# Altium schematic sheet MCU.SchDoc
size 431 x 279 mm; Organization: ORGANIZATION; Address1: 207; Address2: 13399 104 Ave; Address3: Surrey BC, V3T 0C9; Address4: Canada; Revision: V0.0.0; SheetNumber: 4; SheetTotal: 5; ENG_APP_DATE: --/--/--; DSN_APP_DATE: --/--/--; CHK_APP_DATE: --/--/--
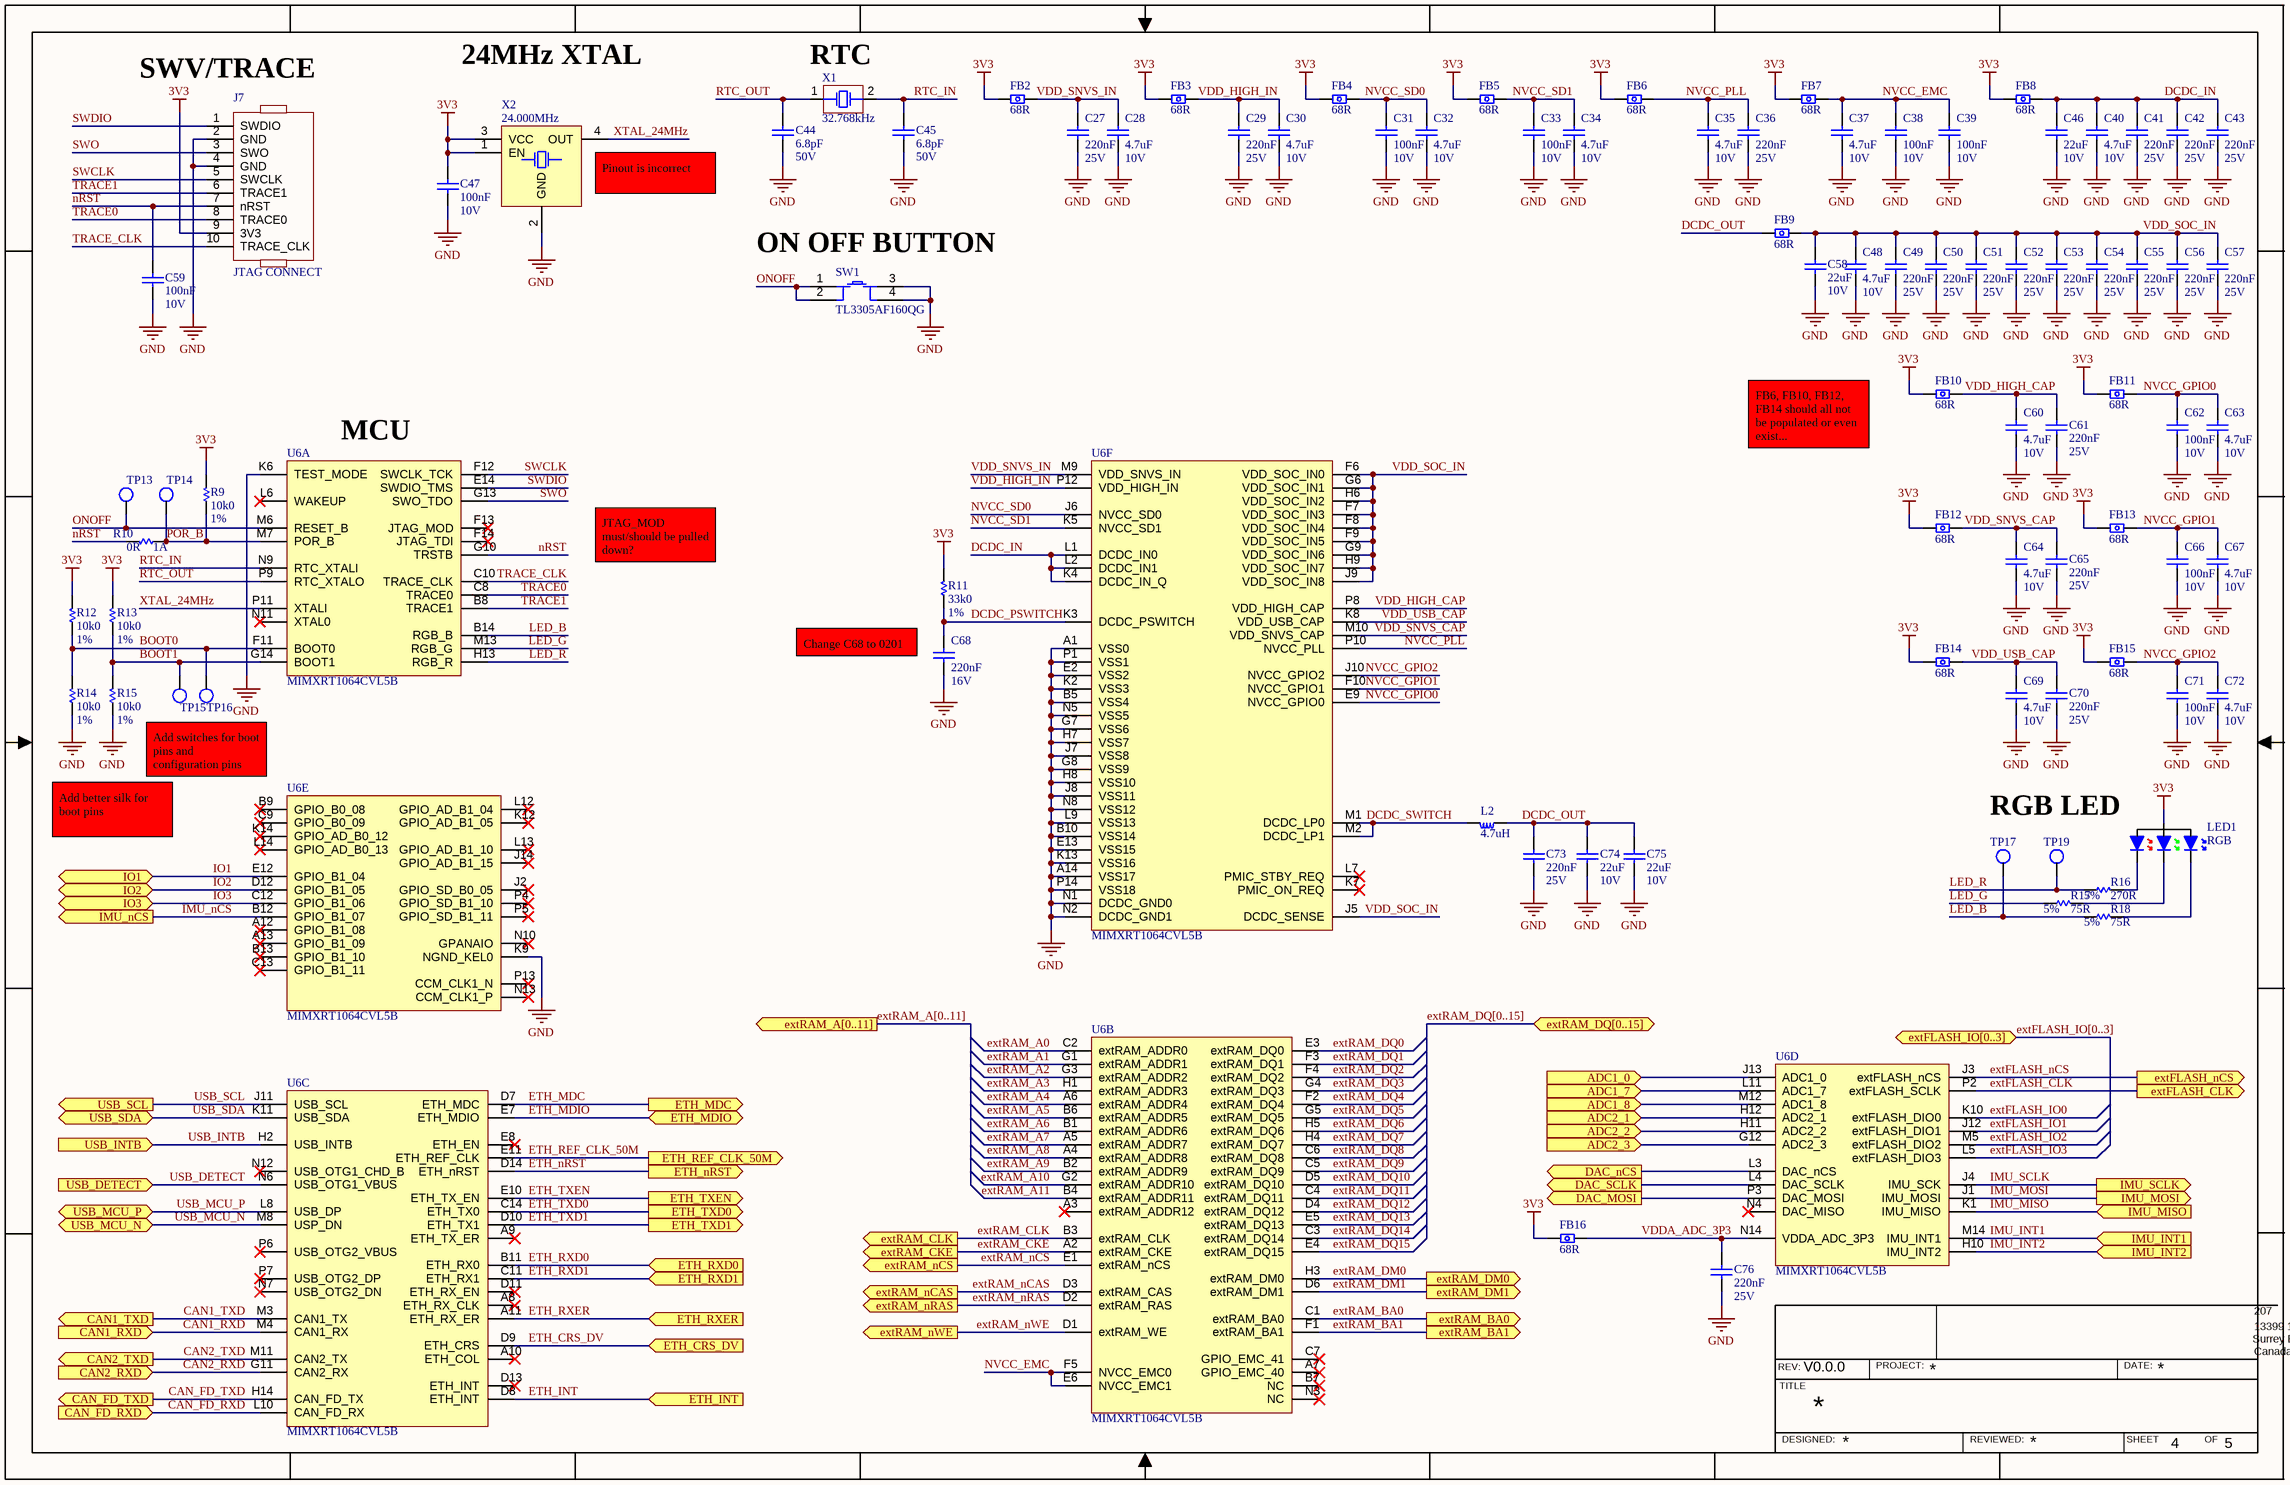
[diagram p0: MCU.SchDoc]

## Parts
C27  220nF  Voltage: 25V  [c0201]
C28  4.7uF  Voltage Rating: 10V  [C0402]
C29  220nF  Voltage: 25V  [c0201]
C30  4.7uF  Voltage Rating: 10V  [C0402]
C31  100nF  Voltage Rating: 10V  [C0201]
C32  4.7uF  Voltage Rating: 10V  [C0402]
C33  100nF  Voltage Rating: 10V  [C0201]
C34  4.7uF  Voltage Rating: 10V  [C0402]
C35  4.7uF  Voltage Rating: 10V  [C0402]
C36  220nF  Voltage: 25V  [c0201]
C37  4.7uF  Voltage Rating: 10V  [C0402]
C38  100nF  Voltage Rating: 10V  [C0201]
C39  100nF  Voltage Rating: 10V  [C0201]
C40  4.7uF  Voltage Rating: 10V  [C0402]
C41  220nF  Voltage: 25V  [c0201]
C42  220nF  Voltage: 25V  [c0201]
C43  220nF  Voltage: 25V  [c0201]
C44  6.8pF  Voltage: 50V  [C0402]
C45  6.8pF  Voltage: 50V  [C0402]
C46  22uF  Voltage Rating: 10V  [c0603]
C47  100nF  Voltage Rating: 10V  [C0201]
C48  4.7uF  Voltage Rating: 10V  [C0402]
C49  220nF  Voltage: 25V  [c0201]
C50  220nF  Voltage: 25V  [c0201]
C51  220nF  Voltage: 25V  [c0201]
C52  220nF  Voltage: 25V  [c0201]
C53  220nF  Voltage: 25V  [c0201]
C54  220nF  Voltage: 25V  [c0201]
C55  220nF  Voltage: 25V  [c0201]
C56  220nF  Voltage: 25V  [c0201]
C57  220nF  Voltage: 25V  [c0201]
C58  22uF  Voltage Rating: 10V  [c0603]
C59  100nF  Voltage Rating: 10V  [C0201]
C60  4.7uF  Voltage Rating: 10V  [C0402]
C61  220nF  Voltage: 25V  [c0201]
C62  100nF  Voltage Rating: 10V  [C0201]
C63  4.7uF  Voltage Rating: 10V  [C0402]
C64  4.7uF  Voltage Rating: 10V  [C0402]
C65  220nF  Voltage: 25V  [c0201]
C66  100nF  Voltage Rating: 10V  [C0201]
C67  4.7uF  Voltage Rating: 10V  [C0402]
C68  220nF  Voltage Rating: 16V  [C0402]
C69  4.7uF  Voltage Rating: 10V  [C0402]
C70  220nF  Voltage: 25V  [c0201]
C71  100nF  Voltage Rating: 10V  [C0201]
C72  4.7uF  Voltage Rating: 10V  [C0402]
C73  220nF  Voltage: 25V  [c0201]
C74  22uF  Voltage Rating: 10V  [c0603]
C75  22uF  Voltage Rating: 10V  [c0603]
C76  220nF  Voltage: 25V  [c0201]
FB2  68R  [FB0402]
FB3  68R  [FB0402]
FB4  68R  [FB0402]
FB5  68R  [FB0402]
FB6  68R  [FB0402]
FB7  68R  [FB0402]
FB8  68R  [FB0402]
FB9  68R  [FB0402]
FB10  68R  [FB0402]
FB11  68R  [FB0402]
FB12  68R  [FB0402]
FB13  68R  [FB0402]
FB14  68R  [FB0402]
FB15  68R  [FB0402]
FB16  68R  [FB0402]
J7  JTAG CONNECT  [TAG_CONNECT_10PIN]  (no BOM)
L2  4.7uH  [INDP3030X12N]
LED1  RGB  [LED RGB UHD1110-FKA-CL1A13R3Q1BBQFMF3]
R9  10k0  Tolerance: 1%  [r0402]
R10  0R  Current Rating: 1A  [R0402]
R11  33k0  Tolerance: 1%  [r0402]
R12  10k0  Tolerance: 1%  [r0402]
R13  10k0  Tolerance: 1%  [r0402]
R14  10k0  Tolerance: 1%  [r0402]
R15  10k0  Tolerance: 1%  [r0402]
R16  270R  Tolerance: 5%  [r0402]
R17  75R  Tolerance: 5%  [R0402]
R18  75R  Tolerance: 5%  [R0402]
SW1  TL3305AF160QG  [MECH PB TL3305A]
TP13  1mm  [TESTPOINT_SMT]  (value not drawn)  (no BOM)
TP14  1mm  [TESTPOINT_SMT]  (value not drawn)  (no BOM)
TP15  1mm  [TESTPOINT_SMT]  (value not drawn)  (no BOM)
TP16  1mm  [TESTPOINT_SMT]  (value not drawn)  (no BOM)
TP17  1mm  [TESTPOINT_SMT]  (value not drawn)  (no BOM)
TP19  1mm  [TESTPOINT_SMT]  (value not drawn)  (no BOM)
U6  MIMXRT1064CVL5B  [BGA196C65P14X14_1000X1000X143]  (parts A,B,C,D,E,F of 6)
X1  32.768kHz  [XTAL 3.2x1.5mm]
X2  24.000MHz  [XTAL FA-238V 3.2x2.5mm]

## Ports
ADC1_0 (in), ADC1_7 (in), ADC1_8 (in), ADC2_1 (in), ADC2_2 (in), ADC2_3 (in), CAN1_RXD (in), CAN1_TXD (out), CAN2_RXD (in), CAN2_TXD (out), CAN_FD_RXD (in), CAN_FD_TXD (out), DAC_MOSI (out), DAC_nCS (out), DAC_SCLK (out), ETH_CRS_DV (in), ETH_INT (in), ETH_MDC (out), ETH_MDIO (bidir), ETH_nRST (out), ETH_REF_CLK_50M (out), ETH_RXD0 (in), ETH_RXD1 (in), ETH_RXER (in), ETH_TXD0 (out), ETH_TXD1 (out), ETH_TXEN (out), extFLASH_CLK (out), extFLASH_IO[0..3] (bidir), extFLASH_nCS (out), extRAM_A[0..11] (out), extRAM_BA0 (out), extRAM_BA1 (out), extRAM_CKE (out), extRAM_CLK (out), extRAM_DM0 (out), extRAM_DM1 (out), extRAM_DQ[0..15] (bidir), extRAM_nCAS (out), extRAM_nCS (out), extRAM_nRAS (out), extRAM_nWE (out), IMU_INT1 (in), IMU_INT2 (in), IMU_MISO (in), IMU_MOSI (out), IMU_nCS (out), IMU_SCLK (out), IO1 (bidir), IO2 (bidir), IO3 (bidir), USB_DETECT (in), USB_INTB (in), USB_MCU_N (bidir), USB_MCU_P (bidir), USB_SCL (out), USB_SDA (bidir)

## Nets
3V3: C47.2 FB2.2 FB3.2 FB4.2 FB5.2 FB6.2 FB7.2 FB8.2 FB10.2 FB11.2 FB12.2 FB13.2 FB14.2 FB15.2 FB16.2 J7.9(3V3) LED1.4(A) R9.2 R11.2 R12.2 R13.2 X2.1(EN) X2.3(VCC)
GND: C27.1 C28.1 C29.1 C30.1 C31.1 C32.1 C33.1 C34.1 C35.1 C36.1 C37.1 C38.1 C39.1 C40.1 C41.1 C42.1 C43.1 C44.1 C45.1 C46.1 C47.1 C48.1 C49.1 C50.1 C51.1 C52.1 C53.1 C54.1 C55.1 C56.1 C57.1 C58.1 C59.1 C60.1 C61.1 C62.1 C63.1 C64.1 C65.1 C66.1 C67.1 C68.1 C69.1 C70.1 C71.1 C72.1 C73.1 C74.1 C75.1 C76.1 J7.2(GND) J7.4(GND) R14.1 R15.1 SW1.3 SW1.4 U6.A1(VSS0) U6.A14(VSS17) U6.B5(VSS4) U6.B10(VSS14) U6.E2(VSS2) U6.E13(VSS15) U6.G7(VSS6) U6.G8(VSS9) U6.H7(VSS7) U6.H8(VSS10) U6.J7(VSS8) U6.J8(VSS11) U6.K2(VSS3) U6.K6(TEST_MODE) U6.K9(NGND_KEL0) U6.K13(VSS16) U6.L9(VSS13) U6.N1(DCDC_GND0) U6.N2(DCDC_GND1) U6.N5(VSS5) U6.N8(VSS12) U6.P1(VSS1) U6.P14(VSS18) X2.2(GND)
ADC1_0: U6.J13(ADC1_0) ; port ADC1_0
ADC1_7: U6.L11(ADC1_7) ; port ADC1_7
ADC1_8: U6.M12(ADC1_8) ; port ADC1_8
ADC2_1: U6.H12(ADC2_1) ; port ADC2_1
ADC2_2: U6.H11(ADC2_2) ; port ADC2_2
ADC2_3: U6.G12(ADC2_3) ; port ADC2_3
BOOT0: R12.1 R14.2 TP16.1 U6.F11(BOOT0)
BOOT1: R13.1 R15.2 TP15.1 U6.G14(BOOT1)
CAN1_RXD: U6.M4(CAN1_RX) ; port CAN1_RXD
CAN1_TXD: U6.M3(CAN1_TX) ; port CAN1_TXD
CAN2_RXD: U6.G11(CAN2_RX) ; port CAN2_RXD
CAN2_TXD: U6.M11(CAN2_TX) ; port CAN2_TXD
CAN_FD_RXD: U6.L10(CAN_FD_RX) ; port CAN_FD_RXD
CAN_FD_TXD: U6.H14(CAN_FD_TX) ; port CAN_FD_TXD
DAC_MOSI: U6.P3(DAC_MOSI) ; port DAC_MOSI
DAC_nCS: U6.L3(DAC_nCS) ; port DAC_nCS
DAC_SCLK: U6.L4(DAC_SCLK) ; port DAC_SCLK
DCDC_IN: C40.2 C41.2 C42.2 C43.2 C46.2 FB8.1 U6.K4(DCDC_IN_Q) U6.L1(DCDC_IN0) U6.L2(DCDC_IN1)
DCDC_OUT: C73.2 C74.2 C75.2 FB9.2 L2.2
DCDC_PSWITCH: C68.2 R11.1 U6.K3(DCDC_PSWITCH)
DCDC_SWITCH: L2.1 U6.M1(DCDC_LP0) U6.M2(DCDC_LP1)
ETH_CRS_DV: U6.D9(ETH_CRS) ; port ETH_CRS_DV
ETH_INT: U6.D8(ETH_INT) ; port ETH_INT
ETH_MDC: U6.D7(ETH_MDC) ; port ETH_MDC
ETH_MDIO: U6.E7(ETH_MDIO) ; port ETH_MDIO
ETH_nRST: U6.D14(ETH_nRST) ; port ETH_nRST
ETH_REF_CLK_50M: U6.E11(ETH_REF_CLK) ; port ETH_REF_CLK_50M
ETH_RXD0: U6.B11(ETH_RX0) ; port ETH_RXD0
ETH_RXD1: U6.C11(ETH_RX1) ; port ETH_RXD1
ETH_RXER: U6.A11(ETH_RX_ER) ; port ETH_RXER
ETH_TXD0: U6.C14(ETH_TX0) ; port ETH_TXD0
ETH_TXD1: U6.D10(ETH_TX1) ; port ETH_TXD1
ETH_TXEN: U6.E10(ETH_TX_EN) ; port ETH_TXEN
extFLASH_CLK: U6.P2(extFLASH_SCLK) ; port extFLASH_CLK
extFLASH_IO0: U6.K10(extFLASH_DIO0)
extFLASH_IO1: U6.J12(extFLASH_DIO1)
extFLASH_IO2: U6.M5(extFLASH_DIO2)
extFLASH_IO3: U6.L5(extFLASH_DIO3)
extFLASH_nCS: U6.J3(extFLASH_nCS) ; port extFLASH_nCS
extRAM_A0: U6.C2(extRAM_ADDR0)
extRAM_A1: U6.G1(extRAM_ADDR1)
extRAM_A2: U6.G3(extRAM_ADDR2)
extRAM_A3: U6.H1(extRAM_ADDR3)
extRAM_A4: U6.A6(extRAM_ADDR4)
extRAM_A5: U6.B6(extRAM_ADDR5)
extRAM_A6: U6.B1(extRAM_ADDR6)
extRAM_A7: U6.A5(extRAM_ADDR7)
extRAM_A8: U6.A4(extRAM_ADDR8)
extRAM_A9: U6.B2(extRAM_ADDR9)
extRAM_A10: U6.G2(extRAM_ADDR10)
extRAM_A11: U6.B4(extRAM_ADDR11)
extRAM_BA0: U6.C1(extRAM_BA0) ; port extRAM_BA0
extRAM_BA1: U6.F1(extRAM_BA1) ; port extRAM_BA1
extRAM_CKE: U6.A2(extRAM_CKE) ; port extRAM_CKE
extRAM_CLK: U6.B3(extRAM_CLK) ; port extRAM_CLK
extRAM_DM0: U6.H3(extRAM_DM0) ; port extRAM_DM0
extRAM_DM1: U6.D6(extRAM_DM1) ; port extRAM_DM1
extRAM_DQ0: U6.E3(extRAM_DQ0)
extRAM_DQ1: U6.F3(extRAM_DQ1)
extRAM_DQ2: U6.F4(extRAM_DQ2)
extRAM_DQ3: U6.G4(extRAM_DQ3)
extRAM_DQ4: U6.F2(extRAM_DQ4)
extRAM_DQ5: U6.G5(extRAM_DQ5)
extRAM_DQ6: U6.H5(extRAM_DQ6)
extRAM_DQ7: U6.H4(extRAM_DQ7)
extRAM_DQ8: U6.C6(extRAM_DQ8)
extRAM_DQ9: U6.C5(extRAM_DQ9)
extRAM_DQ10: U6.D5(extRAM_DQ10)
extRAM_DQ11: U6.C4(extRAM_DQ11)
extRAM_DQ12: U6.D4(extRAM_DQ12)
extRAM_DQ13: U6.E5(extRAM_DQ13)
extRAM_DQ14: U6.C3(extRAM_DQ14)
extRAM_DQ15: U6.E4(extRAM_DQ15)
extRAM_nCAS: U6.D3(extRAM_CAS) ; port extRAM_nCAS
extRAM_nCS: U6.E1(extRAM_nCS) ; port extRAM_nCS
extRAM_nRAS: U6.D2(extRAM_RAS) ; port extRAM_nRAS
extRAM_nWE: U6.D1(extRAM_WE) ; port extRAM_nWE
IMU_INT1: U6.M14(IMU_INT1) ; port IMU_INT1
IMU_INT2: U6.H10(IMU_INT2) ; port IMU_INT2
IMU_MISO: U6.K1(IMU_MISO) ; port IMU_MISO
IMU_MOSI: U6.J1(IMU_MOSI) ; port IMU_MOSI
IMU_nCS: U6.B12(GPIO_B1_07) ; port IMU_nCS
IMU_SCLK: U6.J4(IMU_SCK) ; port IMU_SCLK
IO1: U6.E12(GPIO_B1_04) ; port IO1
IO2: U6.D12(GPIO_B1_05) ; port IO2
IO3: U6.C12(GPIO_B1_06) ; port IO3
LED_B: R18.1 TP17.1 U6.B14(RGB_B)
LED_G: R17.1 U6.M13(RGB_G)
LED_R: R16.1 TP19.1 U6.H13(RGB_R)
nRST: C59.2 J7.7(nRST) R10.2 U6.G10(TRSTB)
NVCC_EMC: C37.2 C38.2 C39.2 FB7.1 U6.E6(NVCC_EMC1) U6.F5(NVCC_EMC0)
NVCC_GPIO0: C62.2 C63.2 FB11.1 U6.E9(NVCC_GPIO0)
NVCC_GPIO1: C66.2 C67.2 FB13.1 U6.F10(NVCC_GPIO1)
NVCC_GPIO2: C71.2 C72.2 FB15.1 U6.J10(NVCC_GPIO2)
NVCC_PLL: C35.2 C36.2 FB6.1 U6.P10(NVCC_PLL)
NVCC_SD0: C31.2 C32.2 FB4.1 U6.J6(NVCC_SD0)
NVCC_SD1: C33.2 C34.2 FB5.1 U6.K5(NVCC_SD1)
ONOFF: SW1.1 SW1.2 TP13.1 U6.M6(RESET_B)
POR_B: R9.1 R10.1 TP14.1 U6.M7(POR_B)
RTC_IN: C45.2 U6.N9(RTC_XTALI) X1.2
RTC_OUT: C44.2 U6.P9(RTC_XTALO) X1.1
SWCLK: J7.5(SWCLK) U6.F12(SWCLK_TCK)
SWDIO: J7.1(SWDIO) U6.E14(SWDIO_TMS)
SWO: J7.3(SWO) U6.G13(SWO_TDO)
TRACE0: J7.8(TRACE0) U6.C8(TRACE0)
TRACE1: J7.6(TRACE1) U6.B8(TRACE1)
TRACE_CLK: J7.10(TRACE_CLK) U6.C10(TRACE_CLK)
USB_DETECT: U6.N6(USB_OTG1_VBUS) ; port USB_DETECT
USB_INTB: U6.H2(USB_INTB) ; port USB_INTB
USB_MCU_N: U6.M8(USP_DN) ; port USB_MCU_N
USB_MCU_P: U6.L8(USB_DP) ; port USB_MCU_P
USB_SCL: U6.J11(USB_SCL) ; port USB_SCL
USB_SDA: U6.K11(USB_SDA) ; port USB_SDA
VDD_HIGH_CAP: C60.2 C61.2 FB10.1 U6.P8(VDD_HIGH_CAP)
VDD_HIGH_IN: C29.2 C30.2 FB3.1 U6.P12(VDD_HIGH_IN)
VDD_SNVS_CAP: C64.2 C65.2 FB12.1 U6.M10(VDD_SNVS_CAP)
VDD_SNVS_IN: C27.2 C28.2 FB2.1 U6.M9(VDD_SNVS_IN)
VDD_SOC_IN: C48.2 C49.2 C50.2 C51.2 C52.2 C53.2 C54.2 C55.2 C56.2 C57.2 C58.2 FB9.1 U6.F6(VDD_SOC_IN0) U6.F7(VDD_SOC_IN3) U6.F8(VDD_SOC_IN4) U6.F9(VDD_SOC_IN5) U6.G6(VDD_SOC_IN1) U6.G9(VDD_SOC_IN6) U6.H6(VDD_SOC_IN2) U6.H9(VDD_SOC_IN7) U6.J5(DCDC_SENSE) U6.J9(VDD_SOC_IN8)
VDD_USB_CAP: C69.2 C70.2 FB14.1 U6.K8(VDD_USB_CAP)
VDDA_ADC_3P3: C76.2 FB16.1 U6.N14(VDDA_ADC_3P3)
XTAL_24MHz: U6.P11(XTALI) X2.4(OUT)
NetLED1_1: LED1.1(K) R18.2
NetLED1_2: LED1.2(K) R17.2
NetLED1_3: LED1.3(K) R16.2

Not connected (* = marked no-connect by the designer): U6 A3(extRAM_ADDR12)* A7(GPIO_EMC_40)* A8(ETH_RX_CLK)* A9(ETH_TX_ER)* A10(ETH_COL)* A12(GPIO_B1_08)* A13(GPIO_B1_09)* B7(NC)* B9(GPIO_B0_08)* B13(GPIO_B1_10)* C7(GPIO_EMC_41)* C9(GPIO_B0_09)* C13(GPIO_B1_11)* D11(ETH_RX_EN)* D13(ETH_INT)* E8(ETH_EN)* F13(JTAG_MOD)* F14(JTAG_TDI)* J2(GPIO_SD_B0_05)* J14(GPIO_AD_B1_15)* K7(PMIC_ON_REQ)* K12(GPIO_AD_B1_05)* K14(GPIO_AD_B0_12)* L6(WAKEUP)* L7(PMIC_STBY_REQ)* L12(GPIO_AD_B1_04)* L13(GPIO_AD_B1_10)* L14(GPIO_AD_B0_13)* N3(NC)* N4(DAC_MISO)* N7(USB_OTG2_DN)* N10(GPANAIO)* N11(XTAL0)* N12(USB_OTG1_CHD_B)* N13(CCM_CLK1_P)* P4(GPIO_SD_B1_10)* P5(GPIO_SD_B1_11)* P6(USB_OTG2_VBUS)* P7(USB_OTG2_DP)* P13(CCM_CLK1_N)*

## Buses and harness runs
bus extFLASH_IO[0..3] = port extFLASH_IO[0..3]
bus extRAM_A[0..11] = port extRAM_A[0..11]
bus extRAM_DQ[0..15] = port extRAM_DQ[0..15]

## Notes on the sheet
- (near J7) SWV/TRACE
- 24MHz XTAL
- (near X1) RTC
- (near X2) Pinout is incorrect
- (near SW1) ON OFF BUTTON
- (near U6) MCU
- FB6, FB10, FB12, FB14 should all not be populated or even exist...
- JTAG_MOD must/should be pulled down?
- Change C68 to 0201
- Add better silk for boot pins
- Add switches for boot pins and configuration pins
- RGB LED
- REV:
- PROJECT:
- DATE:
- TITLE
- SHEET
- OF
- DESIGNED:
- REVIEWED:

## Library data of the parts
C27 C29 C36 C41-C43 C49-C57 C61 C65 C70 C73 C76 = CAP CER 220nF 25V X5R 0201: 0201 0.22 uF 25 V ±20% Tolerance X5R Surface Mount Multilayer Ceramic Capacitor; Manufacturer 1: Murata; Manufacturer Part Number 1: GRM033R61E224ME01D; Category 1: Ceramic Capacitors; Supplier 1: Arrow Electronics; Stock 1: 11352; Pricing 1: 1=0.08690, 10=0.01390, 50=0.01370, 100=0.01130, 500=0.00870, 1000=0.00690, 2500=0.00610, 5000=0.00520, 15000=0.00350 (USD); RoHS Compliant: Yes; Supplier Part Number 1: GRM033R61E224ME01D; RoHS 1: Yes; Description 1: 0201 0.22 uF 25 V ±20% Tolerance X5R Surface Mount Multilayer Ceramic Capacitor
C28 C30 C32 C34 C35 C37 C40 C48 C60 C63 C64 C67 C69 C72 = CAP CER 4.7uF 10V X5R 0402: 0402 10 V 4.7 uF ±20% Tolerance X5R Multilayer Ceramic Chip Capacitor; Manufacturer: Murata; Manufacturer Part Number: GRM155R61A475MEAAD; Supplier 1: Newark; RoHS: Yes; Category: Ceramic Capacitors; Stock 1: 280000; Pricing 1: 1=0.02400, 10000=0.02400, 20000=0.02300, 40000=0.02100, 60000=0.02000 (USD); Mount: Surface Mount; Case/Package: 0402; Case Code (Imperial): 0402; Case Code (Metric): 1005; Min Operating Temperature: -55°C; Max Operating Temperature: 85°C; Packaging: Tape and Reel; Capacitance: 4.7uF; Tolerance: 20%; RoHS Compliant: Yes; ComponentLink1URL: http://www.farnell.com/datasheets/2189109.pdf?src-supplier=Farnell; ComponentLink1Description: http://www.farnell.com/datasheets/2189109.pdf?src-supplier=Farnell; ComponentLink2URL: http://www.farnell.com/datasheets/2189109.pdf?src-supplier=Newark; ComponentLink2Description: http://www.farnell.com/datasheets/2189109.pdf?src-supplier=Newark; ComponentLink3URL: http://www.farnell.com/datasheets/2189109.pdf?src-supplier=Element14; ComponentLink3Description: http://www.farnell.com/datasheets/2189109.pdf?src-supplier=Element14; ComponentLink4URL: https://search.murata.co.jp/Ceramy/image/img/A01X/G101/ENG/GRM155R61A475MEAA-01.pdf?src-supplier=Digi-Key; ComponentLink4Description: https://search.murata.co.jp/Ceramy/image/img/A01X/G101/ENG/GRM155R61A475MEAA-01.pdf?src-supplier=Digi-Key; Supplier Part Number 1: 92AH5018
C31 C33 C38 C39 C47 C59 C62 C66 C71 = CAP CER 100nF 10V X5R 0201: CAP CER 0.1UF 10V X5R 0201; Manufacturer 1: Murata; Manufacturer Part Number 1: GRM033R61A104ME15D; Tolerance: 20%; Category 1: Ceramic Capacitors; Supplier 1: Newark; Stock 1: 345000; Pricing 1: 1=0.00300, 15000=0.00300 (USD); Case/Package: 0201; Case Code (Metric): 0603; Case Code (Imperial): 0201; Min Operating Temperature: -55°C; Max Operating Temperature: 85°C; Dielectric: X5R; Packaging: Tape and Reel; Package Quantity: 10; Series: GRM; Voltage Rating (DC): 10V; Length: 0.024inch; Width: 0.012inch; Thickness: 0.013inch; Depth: 0.3mm; Lead Free: Lead Free; ComponentLink1URL: https://datasheet.ciiva.com/131/partnumbering-e-01-131478.pdf?src-supplier=Digi-Key; ComponentLink1Description: https://datasheet.ciiva.com/131/partnumbering-e-01-131478.pdf?src-supplier=Digi-Key; ComponentLink2URL: https://datasheet.ciiva.com/131/partnumbering-e-01-131479.pdf?src-supplier=Digi-Key; ComponentLink2Description: https://datasheet.ciiva.com/131/partnumbering-e-01-131479.pdf?src-supplier=Digi-Key; Supplier Part Number 1: 65AH6960; RoHS 1: Yes; Description 1: CAP CER 0.1UF 10V X5R 0201; Mounting Technology: Surface Mount; Value: 100nF; RoHS Compliant: Yes
C44 C45 = CAP CER 6.8pF 50V C0G 0402: Ceramic capacitor SMD-0402 6, 8pF /50V C0G# C +-0, 25pF%, Samsung, RoHS; Manufacturer Part Number: CL05C6R8CB5NNNC; Dielectric: C0G; Temperature Coefficient: 300ppm/°C; Supplier 1: Arrow Electronics; Manufacturer: Samsung; RoHS: Yes; Category: Ceramic Capacitors; Stock 1: 70840; Pricing 1: 1=0.04940, 10=0.01800, 25=0.01790, 100=0.00800, 500=0.00550, 1000=0.00420, 3000=0.00380, 6000=0.00370, 15000=0.00360, 30000=0.00350, 10000=0.00550 (USD); Mount: Surface Mount; Case/Package: 0402; Case Code (Metric): 1005; Case Code (Imperial): 0402; Material: Ceramic; Contact Plating: Tin; Min Operating Temperature: -55°C; Max Operating Temperature: 125°C; Capacitance: 6.8pF; Packaging: Tape and Reel; Package Quantity: 1; Voltage Rating: 50V; Series: CL; Construction: Flat; Length: 1mm; Width: 0.02inch; Height: 0.5mm; Thickness: 0.022inch; Depth: 0.5mm; Radiation Hardening: No; RoHS Compliant: Yes; ComponentLink1URL: https://datasheet.ciiva.com/25768/cl05c6r8cb5nnnc-25768613.pdf?src-supplier=Digi-Key; ComponentLink1Description: https://datasheet.ciiva.com/25768/cl05c6r8cb5nnnc-25768613.pdf?src-supplier=Digi-Key; ComponentLink2URL: https://datasheet.ciiva.com/26838/getdatasheetpartid-650911-26838321.pdf?src-supplier=Verical; ComponentLink2Description: https://datasheet.ciiva.com/26838/getdatasheetpartid-650911-26838321.pdf?src-supplier=Verical; ComponentLink3URL: https://datasheet.ciiva.com/29198/458818-da-01-en-vs-kondensator-0402-29198441.pdf?src-supplier=Conrad; ComponentLink3Description: https://datasheet.ciiva.com/29198/458818-da-01-en-vs-kondensator-0402-29198441.pdf?src-supplier=Conrad; Supplier Part Number 1: CL05C6R8CB5NNNC
C46 C58 C74 C75 = CAP CER 22uF 10V X5R 0603: 0603 22 uF 10 V ±20% Tolerance X5R Multilayer Ceramic Chip Capacitor; Manufacturer: Murata; Manufacturer Part Number: GRM188R61A226ME15D; Supplier 1: Newark; RoHS: Yes; Category: Ceramic Capacitors; Stock 1: 3156000; Pricing 1: 1=0.04900, 4000=0.04700, 8000=0.04400, 16000=0.04300, 24000=0.04200 (USD); Mount: Surface Mount; Case/Package: 0603; Case Code (Metric): 1608; Case Code (Imperial): 0603; Material: Ceramic; Weight: 0.000222oz; Min Operating Temperature: -55°C; Max Operating Temperature: 85°C; Capacitance: 22uF; Tolerance: 20%; Packaging: Cut Tape; Dielectric: X5R; Termination: SMD/SMT; Voltage Rating (DC): 10V; Package Quantity: 4000; Series: GRM; Length: 1.6mm; Width: 0.8mm; Height: 0.8mm; Thickness: 0.039inch; Depth: 0.8mm; Reach SVHC Compliant: Yes; Lead Free: Lead Free; RoHS Compliant: Yes; ComponentLink1URL: https://datasheet.ciiva.com/46444/1769893-46444975.pdf?src-supplier=Element14; ComponentLink1Description: https://datasheet.ciiva.com/46444/1769893-46444975.pdf?src-supplier=Element14; Supplier Part Number 1: 03AC2659
C68 = CAP CER 220nF 16V X7R 0402: CAP CER 0.22UF 16V X7R 0402; Manufacturer: Samsung; Manufacturer Part Number: CL05B224KO5NNNC; Tolerance: 10%; Supplier 1: Newark; RoHS: Yes; Category: Ceramic Capacitors; Stock 1: 3820; Pricing 1: 1=0.10000, 25=0.03000, 100=0.01300, 250=0.01100, 500=0.00900, 1000=0.00700 (USD); Mount: Surface Mount; Case/Package: 0402; Case Code (Metric): 1005; Case Code (Imperial): 0402; Min Operating Temperature: -55°C; Max Operating Temperature: 125°C; Capacitance: 220nF; Dielectric: X7R; Packaging: Tape and Reel; Package Quantity: 1; Series: CL; Construction: Flat; Length: 1mm; Width: 0.02inch; Height: 0.5mm; Thickness: 0.022inch; Depth: 0.5mm; Radiation Hardening: No; RoHS Compliant: Yes; ComponentLink1URL: https://datasheet.ciiva.com/25800/cl05b224ko5nnnc-25800450.pdf?src-supplier=Digi-Key; ComponentLink1Description: https://datasheet.ciiva.com/25800/cl05b224ko5nnnc-25800450.pdf?src-supplier=Digi-Key; ComponentLink2URL: https://datasheet.ciiva.com/16428/cl05b224ko5nnnc-16428810.pdf?src-supplier=Future+Electronics; ComponentLink2Description: https://datasheet.ciiva.com/16428/cl05b224ko5nnnc-16428810.pdf?src-supplier=Future+Electronics; ComponentLink3URL: https://datasheet.ciiva.com/26838/getdatasheetpartid-358459-26838228.pdf?src-supplier=Verical; ComponentLink3Description: https://datasheet.ciiva.com/26838/getdatasheetpartid-358459-26838228.pdf?src-supplier=Verical; Supplier Part Number 1: 82AC9227
FB2-FB16 = FB 68R 400mA 310mR 0402: Ferrite Beads Multi-Layer 68Ohm 25% 100MHz 400mA 310mOhm DCR 0402 T/R; Manufacturer: Taiyo Yuden; Manufacturer Part Number: BK1005LL680-T; DC Resistance (DCR): 310mR; Number of Lines: 1; Shielding: Unshielded; Supplier 1: Digi-Key; RoHS: Yes; Category: Ferrite Beads and Chips; Stock 1: 9707; Pricing 1: 1=0.10000, 10=0.04100, 25=0.03640, 50=0.03300, 100=0.02970, 250=0.02176, 500=0.01584, 1000=0.01551, 5000=0.01056 (USD); Mount: Surface Mount; Case/Package: 0402; Number of Pins: 2; Case Code (Metric): 1005; Case Code (Imperial): 0402; Core Material: Ferrite; Min Operating Temperature: -55°C; Max Operating Temperature: 125°C; Packaging: Tape and Reel; Package Quantity: 1; Impedance: 68R; Tolerance: 25%; Max DC Current: 400mA; Termination: SMD/SMT; Test Frequency: 100MHz; Max Current Rating: 400mA; Series: BK; Frequency: 100MHz; Length: 0.039inch; Width: 0.02inch; Height: 0.022inch; Depth: 0.55mm; Halogen Free: Halogen Free; Lead Free: Lead Free; REACH SVHC: Unknown; ComponentLink1URL: https://datasheet.ciiva.com/1013/bk1005ll680-t-ss-1013936.pdf?src-supplier=Digi-Key; ComponentLink1Description: https://datasheet.ciiva.com/1013/bk1005ll680-t-ss-1013936.pdf?src-supplier=Digi-Key; ComponentLink2URL: https://datasheet.ciiva.com/1013/mlci07-e-1013935.pdf?src-supplier=Digi-Key; ComponentLink2Description: https://datasheet.ciiva.com/1013/mlci07-e-1013935.pdf?src-supplier=Digi-Key; ComponentLink3URL: https://datasheet.ciiva.com/1013/mlci07-e-1013937.pdf?src-supplier=Digi-Key; ComponentLink3Description: https://datasheet.ciiva.com/1013/mlci07-e-1013937.pdf?src-supplier=Digi-Key; Supplier Part Number 1: 587-1860-1-ND
J7 = CONN TAG CONNECT 10 SWV: 10 pin jtag tag connect; ComponentLink1Description: http://www.tag-connect.com/Materials/TC-C2000%20DATA%20SHEET.PDF; ComponentLink1URL: http://www.tag-connect.com/Materials/TC-C2000%20DATA%20SHEET.PDF; ComponentLink2Description: http://www.tag-connect.com/Materials/TC2050-IDC%20Datasheet.pdf; ComponentLink2URL: http://www.tag-connect.com/Materials/TC2050-IDC%20Datasheet.pdf
L2 = IND 2.7uH 1A 156mR 3030 NRH3012T4R7MN: Inductor Power Shielded Wirewound 4.7uH 20% 100KHz Ferrite 1.06A 0.156Ohm DCR 1212 T/R; Manufacturer: Taiyo Yuden; Self Resonant Frequency: 50MHz; Max DC Current: 1A; DC Resistance (DCR): 156mR; Supplier 1: Avnet; Manufacturer Part Number: NRH3012T4R7MN; RoHS: Yes; Category: Fixed Inductors; Stock 1: 48000; Pricing 1: 2000=0.09902 (USD); Mount: Surface Mount; Case/Package: 3012; Core Material: Ferrite; Min Operating Temperature: -25°C; Max Operating Temperature: 120°C; Inductance: 4.7uH; Packaging: Tape and Reel; Tolerance: 20%; Package Quantity: 2000; Current Rating: 1.06A; Shielding: Shielded; Termination: SMD/SMT; Test Frequency: 100kHz; Resistor Type: Wirewound; Series: NRH; Saturation Current: 1A; Inductance Tolerance: 20%; RMS Current (Irms): 1.06A; Length: 3mm; Width: 0.118inch; Height: 1.2mm; Height - Seated (Max): 0.047inch; Depth: 3.1mm; Radiation Hardening: No; Lead Free: Lead Free; Halogen Free: Halogen Free; RoHS Compliant: Yes; ComponentLink1URL: https://datasheet.ciiva.com/6689/nrh3012t4r7mn-ss-6689125.pdf?src-supplier=Digi-Key; ComponentLink1Description: https://datasheet.ciiva.com/6689/nrh3012t4r7mn-ss-6689125.pdf?src-supplier=Digi-Key; ComponentLink2URL: https://datasheet.ciiva.com/8502/nrh3012t4r7mn-ss-8502637.pdf?src-supplier=Avnet; ComponentLink2Description: https://datasheet.ciiva.com/8502/nrh3012t4r7mn-ss-8502637.pdf?src-supplier=Avnet; ComponentLink3URL: https://datasheet.ciiva.com/25607/0900766b810b3cd2-25607859.pdf?src-supplier=Rs; ComponentLink3Description: https://datasheet.ciiva.com/25607/0900766b810b3cd2-25607859.pdf?src-supplier=Rs; ComponentLink4URL: https://datasheet.ciiva.com/8002/wound04-e-8002198.pdf?src-supplier=Element14; ComponentLink4Description: https://datasheet.ciiva.com/8002/wound04-e-8002198.pdf?src-supplier=Element14; Supplier Part Number 1: NRH3012T4R7MN
LED1 = LED RGB 5mA UHD1110-FKA-CL1A13R3Q1BBQFMF3: R: Any 1 Intensity Bin From L - 3A4; Rbg: Any 1 Intensity Bin From A to C, Any Consecutive 3NM Within GQ-G4T; B: Any...; Manufacturer: Cree; Supplier 1: Newark; Manufacturer Part Number: UHD1110-FKA-CL1A13R3Q1BBQFMF3; RoHS: Yes; Category: LEDs; ComponentLink1URL: http://www.farnell.com/datasheets/2813772.pdf?src-supplier=Farnell; ComponentLink1Description: http://www.farnell.com/datasheets/2813772.pdf?src-supplier=Farnell; ComponentLink2URL: http://www.farnell.com/datasheets/2813772.pdf?src-supplier=Newark; ComponentLink2Description: http://www.farnell.com/datasheets/2813772.pdf?src-supplier=Newark; Supplier Part Number 1: 72AC4272
R9 R12-R15 = RES 10k0 1% 63mW 0402: Res General Purpose Thick Film 0402 10K Ohm 1% 1/16W ±100ppm/°C Molded SMD Paper T/R; Manufacturer: Yageo; Manufacturer Part Number: RC0402FR-0710KL; Resistance: 10kR; Voltage Rating (DC): 50V; Power Rating: 62.5mW; Max Power Dissipation: 63mW; Supplier 1: RSComponents; RoHS: Yes; Category: Chip SMD Resistors; Stock 1: 29900; Pricing 1: 10000=0.00300 (GBP); Case/Package: 0402; Number of Pins: 2; Case Code (Imperial): 0402; Case Code (Metric): 1005; Min Operating Temperature: -55°C; Max Operating Temperature: 155°C; Resistor Type: Thick Film; Temperature Coefficient: 100ppm/°C; Packaging: Tape and Reel; Voltage Rating: 50V; Termination: SMD/SMT; Working Voltage: 50V; Number of Terminations: 2; Features: Moisture Resistant; Series: RC; Resistance Tolerance: 1%; Construction: Rectangular; Length: 1mm; Width: 0.5mm; Height: 0.32mm; Depth: 0.5mm; Lead Pitch: 0.2mm; REACH SVHC: No SVHC; Lead Free: Lead Free; RoHS Compliant: Yes; Military Standard: Not; ComponentLink1URL: https://datasheet.ciiva.com/7660/38568-7660787.pdf?src-supplier=Element14; ComponentLink1Description: https://datasheet.ciiva.com/7660/38568-7660787.pdf?src-supplier=Element14; ComponentLink2URL: https://datasheet.ciiva.com/12667/pyu-rc0402-51-rohs-l-6-r-12667067.pdf?src-supplier=Mouser; ComponentLink2Description: https://datasheet.ciiva.com/12667/pyu-rc0402-51-rohs-l-6-r-12667067.pdf?src-supplier=Mouser; ComponentLink3URL: https://datasheet.ciiva.com/7849/1784430-7849813.pdf?src-supplier=Element14; ComponentLink3Description: https://datasheet.ciiva.com/7849/1784430-7849813.pdf?src-supplier=Element14; ComponentLink4URL: https://datasheet.ciiva.com/7849/1686128-7849814.pdf?src-supplier=Element14; ComponentLink4Description: https://datasheet.ciiva.com/7849/1686128-7849814.pdf?src-supplier=Element14; ComponentLink5URL: https://datasheet.ciiva.com/7849/1784430-7849815.pdf?src-supplier=Element14; ComponentLink5Description: https://datasheet.ciiva.com/7849/1784430-7849815.pdf?src-supplier=Element14; ComponentLink6URL: https://datasheet.ciiva.com/7983/1018594-7983486.pdf?src-supplier=Element14; ComponentLink6Description: https://datasheet.ciiva.com/7983/1018594-7983486.pdf?src-supplier=Element14; ComponentLink7URL: https://datasheet.ciiva.com/22747/1018594-22747512.pdf?src-supplier=Element14; ComponentLink7Description: https://datasheet.ciiva.com/22747/1018594-22747512.pdf?src-supplier=Element14; Supplier Part Number 1: 1987643
R10 = RES 0R 63mW 0402: GLOVE, POLYAMIDE, L/FREE, PU, SIZE 6 - More Details; Manufacturer: Stackpole Electronics; Manufacturer Part Number: RMCF0402ZT0R00; Power Rating: 63mW; Working Voltage: 50V; Supplier 1: Digi-Key; RoHS: Yes; Category: Chip SMD Resistors; Stock 1: 5203223; Pricing 1: 1=0.10000, 10=0.01000, 25=0.00720, 50=0.00560, 100=0.00410, 250=0.00316, 500=0.00252, 1000=0.00186, 5000=0.00133 (USD); Mount: Surface Mount; Case/Package: 0402; Case Code (Metric): 1005; Case Code (Imperial): 0402; Contact Plating: Tin,Matte; Min Operating Temperature: -55°C; Max Operating Temperature: 155°C; Resistance: 0R; Packaging: Tape and Reel; Resistor Type: Thick Film; Number of Terminations: 2; Max Power Dissipation: 63mW; Features: Automotive AEC-Q200; Series: RMCF; Technology: THICK FILM; Construction: Rectangular; Length: 0.039inch; Width: 0.02inch; Height: 0.016inch; Depth: 0.5mm; Radiation Hardening: No; Military Standard: Not; Lead Free: Lead Free; RoHS Compliant: Yes; ComponentLink1URL: https://datasheet.ciiva.com/26835/getdatasheetpartid-409751-26835612.pdf?src-supplier=Verical; ComponentLink1Description: https://datasheet.ciiva.com/26835/getdatasheetpartid-409751-26835612.pdf?src-supplier=Verical; Supplier Part Number 1: RMCF0402ZT0R00CT-ND
R11 = RES 33k0 1% 63mW 0402: Res Thick Film 0402 33K Ohm 1% 0.063W(1/16W) ±100ppm/C Pad SMD T/R; Manufacturer: Samsung; Manufacturer Part Number: RC1005F333CS; Resistance: 33kR; Max Power Dissipation: 63mW; Temperature Coefficient: 100ppm/°C; Voltage Rating (DC): 50V; Supplier 1: Digi-Key; RoHS: Yes; Category: Chip SMD Resistors; Stock 1: 330000; Pricing 1: 10000=0.00695 (USD); Case/Package: 0402; Case Code (Metric): 1005; Case Code (Imperial): 0402; Contact Plating: Tin; Min Operating Temperature: -55°C; Max Operating Temperature: 155°C; Packaging: Tape and Reel; Resistor Type: Thick Film; Package Quantity: 1; Number of Terminations: 2; Features: Moisture Resistant; Series: RC; Construction: Rectangular; Length: 0.039inch; Width: 0.02inch; Height: 0.016inch; Depth: 0.5mm; Radiation Hardening: No; Military Standard: Not; Lead Free: Lead Free; RoHS Compliant: Yes; ComponentLink1URL: http://components.arrow.com/part/dataview/51978774S9968740N4139?src-supplier=Arrow+Electronics; ComponentLink1Description: http://components.arrow.com/part/dataview/51978774S9968740N4139?src-supplier=Arrow+Electronics; ComponentLink2URL: http://components.arrow.com/part/dataview/0323_06900084?src-supplier=Arrow+Europe; ComponentLink2Description: http://components.arrow.com/part/dataview/0323_06900084?src-supplier=Arrow+Europe; ComponentLink3URL: http://www.samsungsem.com/servlet/FileDownload?type=spec&file=RC1005F9090CS.pdf&src-supplier=Avnet; ComponentLink3Description: http://www.samsungsem.com/servlet/FileDownload?type=spec&file=RC1005F9090CS.pdf&src-supplier=Avnet; ComponentLink4URL: http://www.samsungsem.com/kr/support/product-search/chip-resistor/RC1005F333CS.jsp?src-supplier=Digi-Key; ComponentLink4Description: http://www.samsungsem.com/kr/support/product-search/chip-resistor/RC1005F333CS.jsp?src-supplier=Digi-Key; Supplier Part Number 1: 1276-3461-2-ND
R16 = RES 270R 5% 63mW 0402: Res Thick Film 0402 270 Ohm 5% 0.063W(1/16W) ±100ppm/C Pad SMD Automotive T/R; Manufacturer: Yageo; Manufacturer Part Number: AC0402JR-07270RL; Max Power Dissipation: 63mW; Temperature Coefficient: 100ppm/°C; Supplier 1: Digi-Key; RoHS: Yes; Category: Chip SMD Resistors; Stock 1: 37370; Pricing 1: 1=0.10000, 10=0.01900, 100=0.00780, 1000=0.00350, 2500=0.00304, 5000=0.00251 (USD); Case/Package: 0402; Case Code (Metric): 1005; Case Code (Imperial): 0402; Min Operating Temperature: -55°C; Max Operating Temperature: 155°C; Packaging: Tape and Reel; Resistance: 270R; Resistor Type: Thick Film; Number of Terminations: 2; Features: Moisture Resistant,Automotive AEC-Q200; Length: 0.039inch; Width: 0.02inch; Height: 0.015inch; RoHS Compliant: Yes; ComponentLink1URL: http://www.yageo.com/NewPortal/yageodocoutput?fileName=/pdf/R-Chip/PYu-AC_51_RoHS_L_6.pdf&src-supplier=Digi-Key; ComponentLink1Description: http://www.yageo.com/NewPortal/yageodocoutput?fileName=/pdf/R-Chip/PYu-AC_51_RoHS_L_6.pdf&src-supplier=Digi-Key; Supplier Part Number 1: YAG3534CT-ND
R17 R18 = RES 75R 5% 63mW 0402: Res Thick Film 0402 75 Ohm 5% 0.063W(1/16W) ±100ppm/C Pad SMD Automotive T/R; Manufacturer: Stackpole Electronics; Manufacturer Part Number: RMCF0402JT75R0; Power Rating: 63mW; Temperature Coefficient: 100ppm/°C; Supplier 1: Digi-Key; RoHS: Yes; Category: Chip SMD Resistors; Stock 1: 242174; Pricing 1: 1=0.10000, 10=0.01200, 100=0.00470, 1000=0.00213, 2500=0.00185, 5000=0.00153 (USD); Mount: Surface Mount; Case/Package: 0402; Case Code (Metric): 1005; Case Code (Imperial): 0402; Contact Plating: Tin,Matte; Size Code: 0402; Min Operating Temperature: -55°C; Max Operating Temperature: 155°C; Packaging: Tape and Reel; Resistance: 75R; Resistor Type: Thick Film; Number of Terminations: 2; Max Power Dissipation: 63mW; Features: Automotive AEC-Q200; Series: RMCF; Length: 0.039inch; Width: 0.02inch; Height: 0.016inch; Radiation Hardening: No; Lead Free: Lead Free; RoHS Compliant: Yes; ComponentLink1URL: http://components.arrow.com/part/dataview/50865158S380743N1174?src-supplier=Arrow+Electronics; ComponentLink1Description: http://components.arrow.com/part/dataview/50865158S380743N1174?src-supplier=Arrow+Electronics; ComponentLink2URL: https://www.seielect.com/catalog/SEI-RMCF_RMCP.pdf?src-supplier=Avnet; ComponentLink2Description: https://www.seielect.com/catalog/SEI-RMCF_RMCP.pdf?src-supplier=Avnet; ComponentLink3URL: https://www.seielect.com/catalog/SEI-Packaging.pdf?src-supplier=Digi-Key; ComponentLink3Description: https://www.seielect.com/catalog/SEI-Packaging.pdf?src-supplier=Digi-Key; ComponentLink4URL: https://www.seielect.com/Catalog/SEI-RMCF_RMCP.pdf?src-supplier=Digi-Key; ComponentLink4Description: https://www.seielect.com/Catalog/SEI-RMCF_RMCP.pdf?src-supplier=Digi-Key; ComponentLink5URL: http://www.seielect.com/Catalog/Sei-RMC.pdf?src-supplier=Future+Electronics; ComponentLink5Description: http://www.seielect.com/Catalog/Sei-RMC.pdf?src-supplier=Future+Electronics; Supplier Part Number 1: RMCF0402JT75R0CT-ND
SW1 = MECH PB SPST TL3305AF160QG: TL3305A Series SPST 12 V 4.5 x 4.5 mm 160 gf Top Actuated SMT Tactile Switch; Manufacturer: E-Switch; Mechanical Life: 500000Cycles; Illumination Type: Non-Illuminated; Operating Force: 160gf; Switch Travel: 0.2mm; Switch Function: Off-Mom; Actuator Type: Standard; Supplier 1: Newark; Manufacturer Part Number: TL3305AF160QG; RoHS: Yes; Category: Tactile Switches; Stock 1: 19079; Pricing 1: 1=0.22000, 10=0.21000, 25=0.20000, 50=0.19000, 100=0.18000, 250=0.17000 (USD); Mount: Surface Mount; Min Operating Temperature: -20°C; Max Operating Temperature: 70°C; Packaging: Tape and Reel; Termination: Gull Wing; Throw Configuration: SPST; Lead Free: Lead Free; RoHS Compliant: Yes; ComponentLink1URL: http://www.farnell.com/datasheets/2554191.pdf?src-supplier=Farnell; ComponentLink1Description: http://www.farnell.com/datasheets/2554191.pdf?src-supplier=Farnell; ComponentLink2URL: http://www.farnell.com/datasheets/2554191.pdf?src-supplier=Newark; ComponentLink2Description: http://www.farnell.com/datasheets/2554191.pdf?src-supplier=Newark; ComponentLink3URL: http://spec_sheets.e-switch.com/specs/P010468.pdf?src-supplier=Digi-Key; ComponentLink3Description: http://spec_sheets.e-switch.com/specs/P010468.pdf?src-supplier=Digi-Key; Supplier Part Number 1: 84Y2774
TP13-TP17 TP19 = TP 1mm: SMT testpoint
U6 = IC MCU 600MHz LaserDriver MIMXRT1064CVL5B: i.MXRT1064 USB Fix 10 / TRAY TRAY MULTIPLE DP BAKEABLE RoHS Compliant: Yes; Manufacturer: NXP Semiconductors; Supplier 1: LCSC; Manufacturer Part Number: MIMXRT1064CVL5B; RoHS: Yes; Category: Microcontrollers; Stock 1: 1606; Pricing 1: 1=11.87460, 10=11.42440, 30=10.64320, 100=9.68230 (USD); Supplier Part Number 1: C2879860
X1 = XTAL 32.768kHz 20ppm 12.5pF 3.2x1.5mm: Crystal 0.032768MHz ±20ppm (Tol) 12.5pF Flexural 70000Ohm 2-Pin Ultra Mini-CSMD T/R; Manufacturer: ECS International; Manufacturer Part Number: ECS-.327-12.5-34B-TR; ESR (Equivalent Series Resistance): 70kR; Supplier 1: Digi-Key; RoHS: Yes; Category: Crystals; Stock 1: 74617; Pricing 1: 1=0.80000, 10=0.70800, 50=0.66220, 100=0.58520, 500=0.55440, 1000=0.46200 (USD); Mount: Surface Mount; Case/Package: SMD/SMT; Number of Pins: 2; Min Operating Temperature: -40°C; Max Operating Temperature: 85°C; Frequency: 32.768kHz; Packaging: Tape and Reel; Package Quantity: 3000; Load Capacitance: 12.5pF; Termination: SMD/SMT; Frequency Tolerance: 20ppm; Series: ECX-31B; Length: 0.126inch; Width: 0.059inch; Height: 0.035inch; RoHS Compliant: Yes; ComponentLink1URL: http://www.mouser.com/ds/2/122/ecx-31b-1108368.pdf?src-supplier=Mouser; ComponentLink1Description: http://www.mouser.com/ds/2/122/ecx-31b-1108368.pdf?src-supplier=Mouser; ComponentLink2URL: http://www.ecsxtal.com/store/pdf/partnumber4.pdf?src-supplier=Digi-Key; ComponentLink2Description: http://www.ecsxtal.com/store/pdf/partnumber4.pdf?src-supplier=Digi-Key; ComponentLink3URL: http://www.ecsxtal.com/store/pdf/ecx-31b.pdf?src-supplier=Digi-Key; ComponentLink3Description: http://www.ecsxtal.com/store/pdf/ecx-31b.pdf?src-supplier=Digi-Key; Supplier Part Number 1: XC1617CT-ND
X2 = XTAL OSC MEMS 24MHz 15pF ASEM1-24.000MHZ-LC-T: Oscillator MEMS 24MHz ±50ppm (Stability) 15pF LVCMOS 55% 3.3V Automotive 4-Pin QFN SMD T/R; Manufacturer: Abracon; Max Supply Current: 10mA; Supplier 1: Newark; Manufacturer Part Number: ASEM1-24.000MHZ-LC-T; RoHS: Yes; Category: Oscillators; Stock 1: 386; Pricing 1: 1=2.01000, 10=1.92000, 25=1.90000, 50=1.87000, 100=1.61000 (USD); Mount: Surface Mount; Case/Package: SMD/SMT; Number of Pins: 4; Min Operating Temperature: -40°C; Max Operating Temperature: 85°C; Frequency: 24MHz; Packaging: Tape and Reel; Load Capacitance: 15pF; Frequency Stability: 50ppm; Series: Pure Silicon™ ASEM; Package Quantity: 1000; Operating Supply Voltage: 3.3V; Termination: SMD/SMT; Operating Frequency: 24 MHz; Length: 0.126inch; Width: 0.098inch; Height: 0.035inch; Radiation Hardening: No; Lead Free: Lead Free; ComponentLink1URL: https://datasheet.ciiva.com/868/asem-868994.pdf?src-supplier=Digi-Key; ComponentLink1Description: https://datasheet.ciiva.com/868/asem-868994.pdf?src-supplier=Digi-Key; ComponentLink2URL: https://datasheet.ciiva.com/868/asem-868995.pdf?src-supplier=Digi-Key; ComponentLink2Description: https://datasheet.ciiva.com/868/asem-868995.pdf?src-supplier=Digi-Key; ComponentLink3URL: https://datasheet.ciiva.com/868/asem-868996.pdf?src-supplier=Digi-Key; ComponentLink3Description: https://datasheet.ciiva.com/868/asem-868996.pdf?src-supplier=Digi-Key; ComponentLink4URL: https://datasheet.ciiva.com/9312/asem-9312779.pdf?src-supplier=Avnet; ComponentLink4Description: https://datasheet.ciiva.com/9312/asem-9312779.pdf?src-supplier=Avnet; ComponentLink5URL: https://datasheet.ciiva.com/25665/asem-25665591.pdf?src-supplier=Future+Electronics; ComponentLink5Description: https://datasheet.ciiva.com/25665/asem-25665591.pdf?src-supplier=Future+Electronics; Supplier Part Number 1: 89AH0830